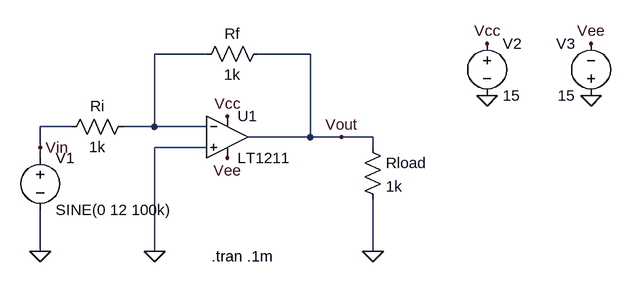
[diagram p0: schematic Inverting Amp.asc]
Inverting Amp.asc, the LTspice schematic file:
Version 4
SHEET 1 880 680
WIRE 112 32 32 32
WIRE 272 32 192 32
WIRE -96 144 -144 144
WIRE 32 144 32 32
WIRE 32 144 -16 144
WIRE 112 144 32 144
WIRE 272 160 272 32
WIRE 272 160 176 160
WIRE 320 160 272 160
WIRE 368 160 320 160
WIRE -144 176 -144 144
WIRE 112 176 32 176
WIRE 368 176 368 160
WIRE -144 192 -144 176
WIRE -144 336 -144 272
WIRE 32 336 32 176
WIRE 368 336 368 256
FLAG -144 336 0
FLAG 32 336 0
FLAG 368 336 0
FLAG 544 96 0
FLAG 704 96 0
FLAG 544 16 Vcc
FLAG 704 16 Vee
FLAG 144 128 Vcc
FLAG 144 192 Vee
FLAG -144 176 Vin
FLAG 320 160 Vout
SYMBOL OpAmps\\LT1211 144 96 R0
SYMATTR InstName U1
SYMBOL res 0 128 R90
WINDOW 0 0 56 VBottom 2
WINDOW 3 32 56 VTop 2
SYMATTR InstName Ri
SYMATTR Value 1k
SYMBOL res 208 16 R90
WINDOW 0 0 56 VBottom 2
WINDOW 3 32 56 VTop 2
SYMATTR InstName Rf
SYMATTR Value 1k
SYMBOL res 352 160 R0
SYMATTR InstName Rload
SYMATTR Value 1k
SYMBOL voltage -144 176 R0
WINDOW 123 0 0 Left 0
WINDOW 39 0 0 Left 0
SYMATTR InstName V1
SYMATTR Value SINE(0 12 100k)
SYMBOL voltage 544 0 R0
WINDOW 123 0 0 Left 0
WINDOW 39 0 0 Left 0
SYMATTR InstName V2
SYMATTR Value 15
SYMBOL voltage 704 112 R180
WINDOW 0 24 96 Left 2
WINDOW 3 24 16 Left 2
WINDOW 123 0 0 Left 0
WINDOW 39 0 0 Left 0
SYMATTR InstName V3
SYMATTR Value 15
TEXT 120 344 Left 2 !.tran .1m

The netlist it stands for:
* Inverting Amp.asc
XU1 0 N001 Vcc Vee Vout LT1211  ; pins In+ In- V+ V- OUT
Ri N001 Vin 1k
Rf Vout N001 1k
Rload Vout 0 1k
V1 Vin 0 SINE(0 12 100k)
V2 Vcc 0 15
V3 0 Vee 15
.tran .1m
.lib LTC.lib
.backanno
.end